# Altium schematic sheet minireg-xcl247.SchDoc
size A4; SheetNumber: 1; SheetTotal: 1
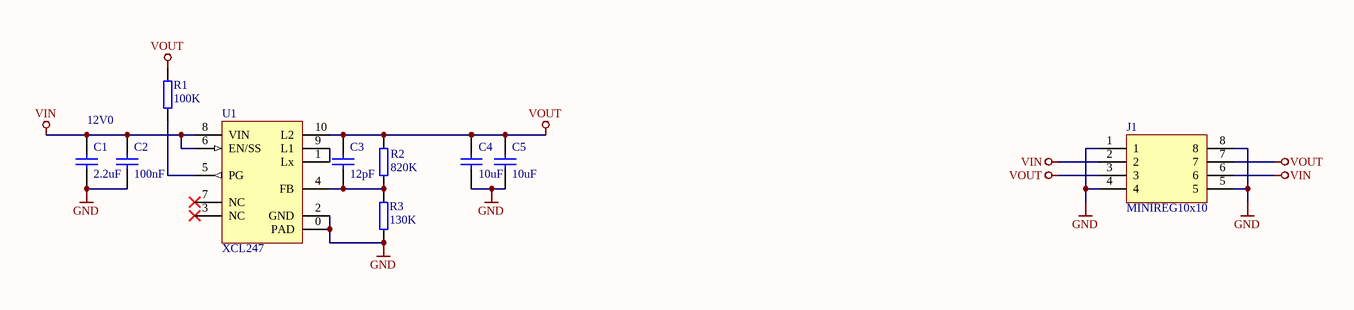
[diagram p0: minireg-xcl247.SchDoc]

## Parts
C1  value 2.2uF  [CAP0603]  (hidden comment: CAP)
C2  value 100nF  [CAP0603]  (hidden comment: CAP)
C3  value 12pF  [CAP0603]  (hidden comment: CAP)
C4  value 10uF  [CAP0603]  (hidden comment: CAP)
C5  value 10uF  [CAP0603]  (hidden comment: CAP)
J1  MINIREG10x10  [MINIREG8_10x10R]
R1  value 100K  [RES0603]  (hidden comment: RES)
R2  value 820K  [RES0603]  (hidden comment: RES)
R3  value 130K  [RES0603]  (hidden comment: RES)
U1  XCL247  [TOREX DFN3030-10B]

## Nets
GND: C1.1 C2.1 C4.1 C5.1 J1.1 J1.4 J1.5 J1.8 R3.1 U1.0(PAD) U1.2(GND)
VIN: C1.2 C2.2 J1.2 J1.6 U1.6(EN/SS) U1.8(VIN)
VOUT: C3.2 C4.2 C5.2 J1.3 J1.7 R1.2 R2.2 U1.10(L2)
NetC3_1: C3.1 R2.1 R3.2 U1.4(FB)
NetR1_1: R1.1 U1.5(PG)
NetU1_1: U1.1(Lx) U1.9(L1)

Not connected (* = marked no-connect by the designer): U1 3(NC)* 7(NC)*

## Notes on the sheet
- 12V0

## Library data of the parts
C1 = CAP-SM-0603-X5R-2.2uF: CAP SM 0603 X5R 2.2uF; Manufacturer: GENERIC; Part Number: CAP-SM-0603-X5R-2.2uF; Package: 0603
C2 = CAP-SM-0603-X7R-100nF: CAP SM 0603 X7R 100nF; Manufacturer: GENERIC; Part Number: CAP-SM-0603-X7R-100nF; Package: 0603
C3 = CAP-SM-0603-NP0-12pF: CAP SM 0603 NP0 12pF; Manufacturer: GENERIC; Part Number: CAP-SM-0603-NP0-12pF; Package: 0603
C4 C5 = CAP-SM-0603-X5R-10uF: CAP SM 0603 X5R 10uF; Manufacturer: GENERIC; Part Number: CAP-SM-0603-X5R-10uF; Package: 0603
R1 = RES-SM-0603-100K: RES SM 0603 100K; Manufacturer: GENERIC; Part Number: RES-SM-0603-100K; Package: 0603
R2 = RES-SM-0603-820K: RES SM 0603 820K; Manufacturer: GENERIC; Part Number: RES-SM-0603-820K; Package: 0603
R3 = RES-SM-0603-130K: RES SM 0603 130K; Manufacturer: GENERIC; Part Number: RES-SM-0603-130K; Package: 0603